# EAGLE design rpi-adapter (EAGLE 5.12)

## Sheet 1 of 7
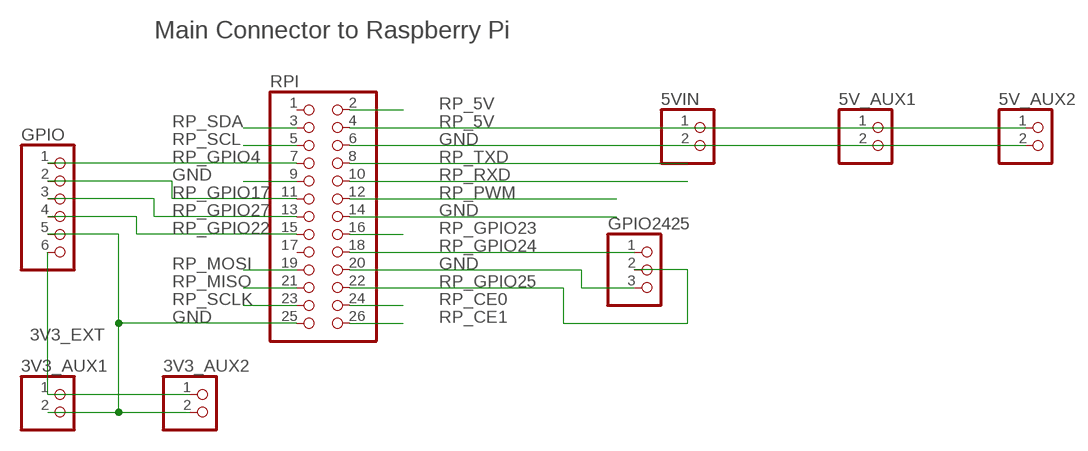
[diagram p0: schematic, sheet 1]

### Parts
3V3_AUX1  PINHD-1X2  [1X02]
3V3_AUX2  PINHD-1X2  [1X02]
5V_AUX1  PINHD-1X2  [1X02]
5V_AUX2  PINHD-1X2  [1X02]
5VIN  PINHD-1X2  [1X02]
GPIO  PINHD-1X6  [1X06]
GPIO2425  PINHD-1X3  [1X03]
RPI  PINHD-2X13  [2X13]

### Nets
3V3_EXT: 3V3_AUX1.1 3V3_AUX2.1 GPIO.6 ; also sheet 6,7
GND: 3V3_AUX1.2 3V3_AUX2.2 5V_AUX1.2 5V_AUX2.2 5VIN.2 GPIO2425.3 GPIO.5 RPI.6 RPI.9 RPI.14 RPI.20 RPI.25 ; also sheet 2,3,5,6,7
RP_5V: 5V_AUX1.1 5V_AUX2.1 5VIN.1 RPI.2 RPI.4 ; also sheet 2,4,5,6,7
RP_CE0: RPI.24 ; also sheet 3
RP_CE1: RPI.26 ; also sheet 2
RP_GPIO4: GPIO.1 RPI.7
RP_GPIO17: GPIO.2 RPI.11
RP_GPIO22: GPIO.4 RPI.15
RP_GPIO23: RPI.16 ; also sheet 2
RP_GPIO24: GPIO2425.1 RPI.18
RP_GPIO25: GPIO2425.2 RPI.22
RP_GPIO27: GPIO.3 RPI.13
RP_MISO: RPI.21 ; also sheet 2,3
RP_MOSI: RPI.19 ; also sheet 2,3
RP_PWM: RPI.12 ; also sheet 2
RP_RXD: RPI.10 ; also sheet 2
RP_SCL: RPI.5 ; also sheet 6
RP_SCLK: RPI.23 ; also sheet 2,3
RP_SDA: RPI.3 ; also sheet 6
RP_TXD: RPI.8 ; also sheet 2
Unconnected: RPI.1 RPI.17

### Notes on the sheet
- Main Connector to Raspberry Pi

## Sheet 2 of 7
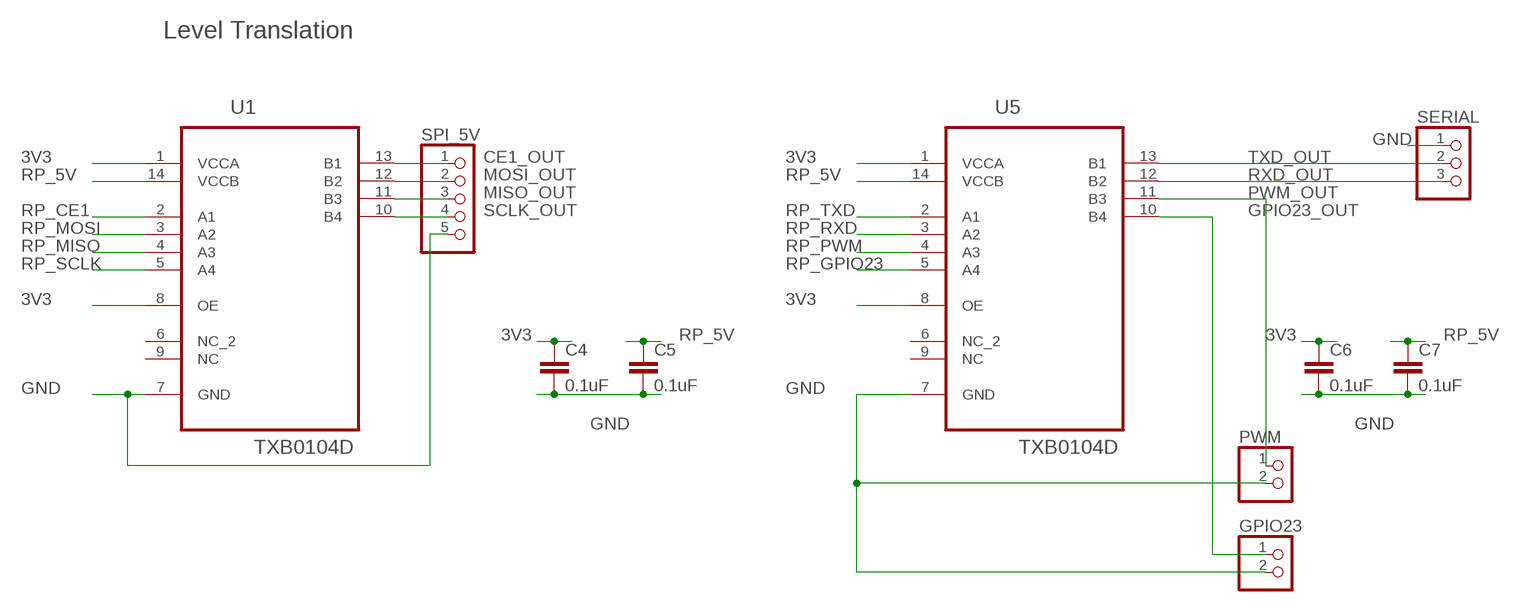
[diagram p1: schematic, sheet 2]

### Parts
C4  0.1uF  C-EUC0603  [C0603]
C5  0.1uF  C-EUC0603  [C0603]
C6  0.1uF  C-EUC0603  [C0603]
C7  0.1uF  C-EUC0603  [C0603]
GPIO23  PINHD-1X2  [1X02]
PWM  PINHD-1X2  [1X02]
SERIAL  PINHD-1X3  [1X03]
SPI_5V  PINHD-1X5  [1X05]
U1  TXB0104D  [SOIC127P600X175-14N]
U5  TXB0104D  [SOIC127P600X175-14N]

### Nets
3V3: C4.1 C6.1 U1.1(VCCA) U1.8(OE) U5.1(VCCA) U5.8(OE) ; also sheet 3,4,6,7
CE1_OUT: SPI_5V.1 U1.13(B1)
GND: C4.2 C5.2 C6.2 C7.2 GPIO23.2 PWM.2 SERIAL.1 SPI_5V.5 U1.7(GND) U5.7(GND) ; also sheet 1,3,5,6,7
GPIO23_OUT: GPIO23.1 U5.10(B4)
MISO_OUT: SPI_5V.3 U1.11(B3)
MOSI_OUT: SPI_5V.2 U1.12(B2)
PWM_OUT: PWM.1 U5.11(B3)
RP_5V: C5.1 C7.1 U1.14(VCCB) U5.14(VCCB) ; also sheet 1,4,5,6,7
RP_CE1: U1.2(A1) ; also sheet 1
RP_GPIO23: U5.5(A4) ; also sheet 1
RP_MISO: U1.4(A3) ; also sheet 1,3
RP_MOSI: U1.3(A2) ; also sheet 1,3
RP_PWM: U5.4(A3) ; also sheet 1
RP_RXD: U5.3(A2) ; also sheet 1
RP_SCLK: U1.5(A4) ; also sheet 1,3
RP_TXD: U5.2(A1) ; also sheet 1
RXD_OUT: SERIAL.3 U5.12(B2)
SCLK_OUT: SPI_5V.4 U1.10(B4)
TXD_OUT: SERIAL.2 U5.13(B1)
Unconnected: U1.6(NC_2) U1.9(NC) U5.6(NC_2) U5.9(NC)

### Notes on the sheet
- Level Translation

## Sheet 3 of 7
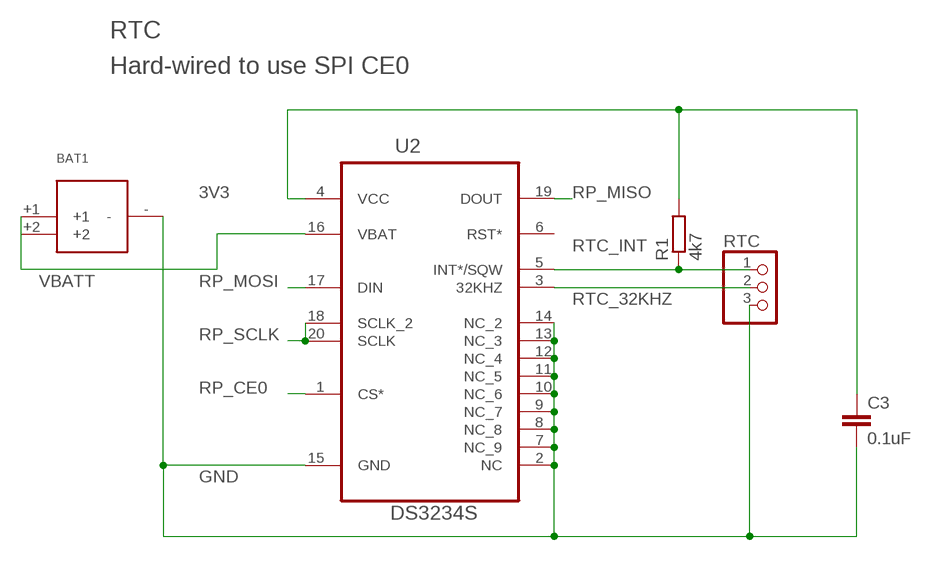
[diagram p2: schematic, sheet 3]

### Parts
BAT1  HU2032-LF  [HU2032-LF]
C3  0.1uF  C-EUC0603  [C0603]
R1  4k7  R-EU_R0805  [R0805]
RTC  PINHD-1X3  [1X03]
U2  DS3234S  [SOIC127P1032X265-20N]

### Nets
3V3: C3.1 R1.2 U2.4(VCC) ; also sheet 2,4,6,7
GND: BAT1.- C3.2 RTC.3 U2.2(NC) U2.7(NC_9) U2.8(NC_8) U2.9(NC_7) U2.10(NC_6) U2.11(NC_5) U2.12(NC_4) U2.13(NC_3) U2.14(NC_2) U2.15(GND) ; also sheet 1,2,5,6,7
RP_CE0: U2.1(CS*) ; also sheet 1
RP_MISO: U2.19(DOUT) ; also sheet 1,2
RP_MOSI: U2.17(DIN) ; also sheet 1,2
RP_SCLK: U2.18(SCLK_2) U2.20(SCLK) ; also sheet 1,2
RTC_32KHZ: RTC.2 U2.3(32KHZ)
RTC_INT: R1.1 RTC.1 U2.5(INT*/SQW)
VBATT: BAT1.+1 BAT1.+2 U2.16(VBAT)
Unconnected: U2.6(RST*)

### Notes on the sheet
- RTC
- Hard-wired to use SPI CE0

## Sheet 4 of 7
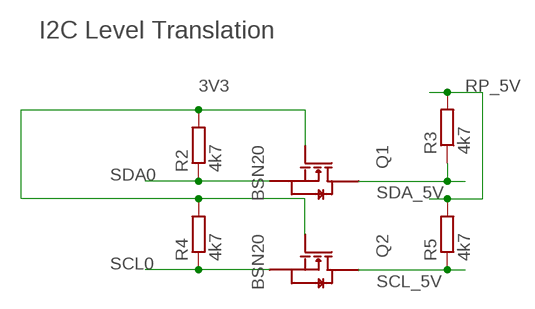
[diagram p3: schematic, sheet 4]

### Parts
Q1  BSN20  [SOT23]
Q2  BSN20  [SOT23]
R2  4k7  R-EU_R0603  [R0603]
R3  4k7  R-EU_R0603  [R0603]
R4  4k7  R-EU_R0603  [R0603]
R5  4k7  R-EU_R0603  [R0603]

### Nets
3V3: Q1.1(G) Q2.1(G) R2.2 R4.2 ; also sheet 2,3,6,7
RP_5V: R3.2 R5.2 ; also sheet 1,2,5,6,7
SCL0: Q2.2(S) R4.1 ; also sheet 6
SCL_5V: Q2.3(D) R5.1 ; also sheet 5,6
SDA0: Q1.2(S) R2.1 ; also sheet 6
SDA_5V: Q1.3(D) R3.1 ; also sheet 5,6

### Notes on the sheet
- I2C Level Translation

## Sheet 5 of 7
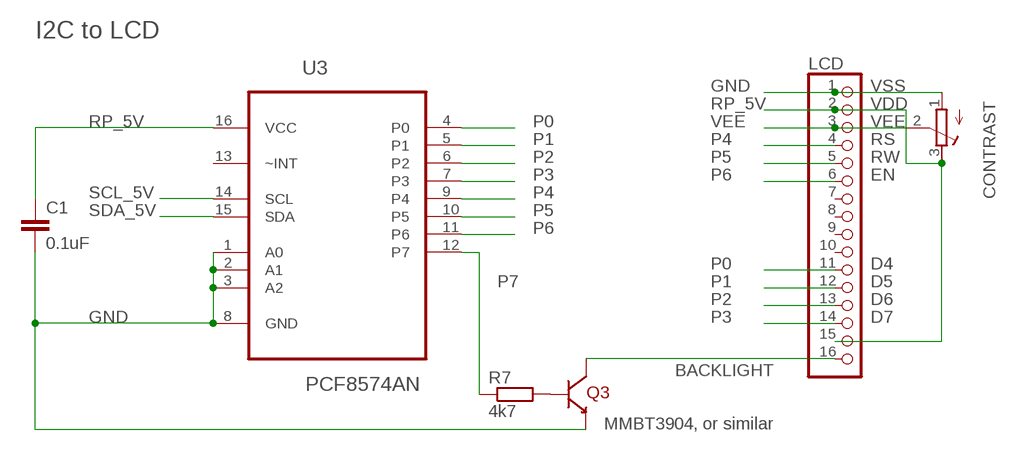
[diagram p4: schematic, sheet 5]

### Parts
C1  0.1uF  C-EUC0603  [C0603]
CONTRAST  R-TRIMM64W  [RTRIM64W]
LCD  PINHD-1X16  [1X16]
Q3  MMBT3904LT1-D  [SOT23]
R7  4k7  R-EU_R0603  [R0603]
U3  PCF8574AN  [DIP254P762X508-16]

### Nets
BACKLIGHT: LCD.16 Q3.3(3C)
GND: C1.2 CONTRAST.1(A) LCD.1 Q3.2(2E) U3.1(A0) U3.2(A1) U3.3(A2) U3.8(GND) ; also sheet 1,2,3,6,7
N$1: Q3.1(1B) R7.2
P0: LCD.11 U3.4(P0)
P1: LCD.12 U3.5(P1)
P2: LCD.13 U3.6(P2)
P3: LCD.14 U3.7(P3)
P4: LCD.4 U3.9(P4)
P5: LCD.5 U3.10(P5)
P6: LCD.6 U3.11(P6)
P7: R7.1 U3.12(P7)
RP_5V: C1.1 CONTRAST.3(E) LCD.2 LCD.15 U3.16(VCC) ; also sheet 1,2,4,6,7
SCL_5V: U3.14(SCL) ; also sheet 4,6
SDA_5V: U3.15(SDA) ; also sheet 4,6
VEE: CONTRAST.2(S) LCD.3
Unconnected: LCD.7 LCD.8 LCD.9 LCD.10 U3.13(~INT)

### Notes on the sheet
- I2C to LCD
- VSS
- VDD
- VEE
- RS
- RW
- EN
- D4
- D5
- D6
- D7
- MMBT3904, or similar

## Sheet 6 of 7
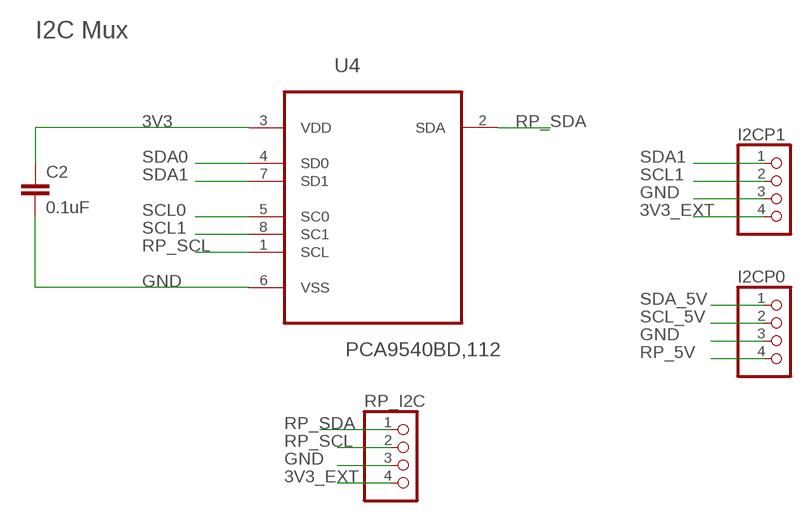
[diagram p5: schematic, sheet 6]

### Parts
C2  0.1uF  C-EUC0603  [C0603]
I2CP0  PINHD-1X4  [1X04]
I2CP1  PINHD-1X4  [1X04]
RP_I2C  PINHD-1X4  [1X04]
U4  PCA9540BD,112  [SOIC127P600X175-8N]

### Nets
3V3: C2.1 U4.3(VDD) ; also sheet 2,3,4,7
3V3_EXT: I2CP1.4 RP_I2C.4 ; also sheet 1,7
GND: C2.2 I2CP0.3 I2CP1.3 RP_I2C.3 U4.6(VSS) ; also sheet 1,2,3,5,7
RP_5V: I2CP0.4 ; also sheet 1,2,4,5,7
RP_SCL: RP_I2C.2 U4.1(SCL) ; also sheet 1
RP_SDA: RP_I2C.1 U4.2(SDA) ; also sheet 1
SCL0: U4.5(SC0) ; also sheet 4
SCL1: I2CP1.2 U4.8(SC1)
SCL_5V: I2CP0.2 ; also sheet 4,5
SDA0: U4.4(SD0) ; also sheet 4
SDA1: I2CP1.1 U4.7(SD1)
SDA_5V: I2CP0.1 ; also sheet 4,5

### Notes on the sheet
- I2C Mux

## Sheet 7 of 7
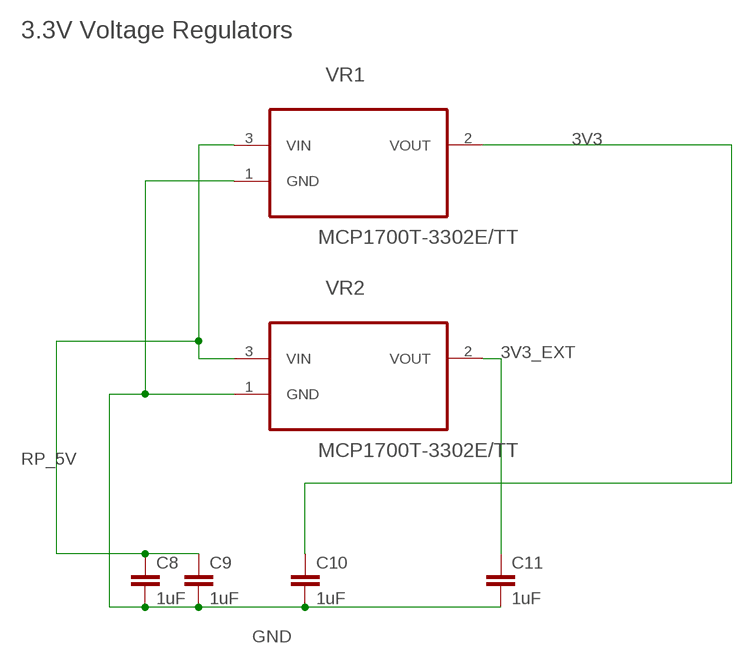
[diagram p6: schematic, sheet 7]

### Parts
C8  1uF  C-EUC0805  [C0805]
C9  1uF  C-EUC0805  [C0805]
C10  1uF  C-EUC0805  [C0805]
C11  1uF  C-EUC0805  [C0805]
VR1  MCP1700T-3302E/TT  [SOT95P237X112-3N]
VR2  MCP1700T-3302E/TT  [SOT95P237X112-3N]

### Nets
3V3: C10.1 VR1.2(VOUT) ; also sheet 2,3,4,6
3V3_EXT: C11.1 VR2.2(VOUT) ; also sheet 1,6
GND: C8.2 C9.2 C10.2 C11.2 VR1.1(GND) VR2.1(GND) ; also sheet 1,2,3,5,6
RP_5V: C8.1 C9.1 VR1.3(VIN) VR2.3(VIN) ; also sheet 1,2,4,5,6

### Notes on the sheet
- 3.3V Voltage Regulators

## Library data of the parts
3V3_AUX1 3V3_AUX2 5V_AUX1 5V_AUX2 5VIN GPIO23 PWM = pinhead:PINHD-1X2: PIN HEADER
BAT1 = mss:HU2032-LF: CR2032 Coin cell holder
C1-C11 = rcl:C-EU: CAPACITOR, European symbol
CONTRAST = rcl:R-TRIMM: Trimm resistor
GPIO = pinhead:PINHD-1X6: PIN HEADER
GPIO2425 RTC SERIAL = pinhead:PINHD-1X3: PIN HEADER
I2CP0 I2CP1 RP_I2C = pinhead:PINHD-1X4: PIN HEADER
LCD = pinhead:PINHD-1X16: PIN HEADER
Q1 Q2 = mss:BSN20: N-channel enhancement mode ?eld-effect transistor (NXP)
Q3 = mss:MMBT3904LT1-D: MMBT3904 General purpose NPN transistor VCEO 40V IC 200mA
R1-R5 R7 = rcl:R-EU_: RESISTOR, European symbol
RPI = pinhead:PINHD-2X13: PIN HEADER
SPI_5V = pinhead:PINHD-1X5: PIN HEADER
U1 U5 = mss:TXB0104D: 4-BIT BIDIRECTIONAL VOLTAGE-LEVEL TRANSLATOR WITH AUTOMATIC DIRECTION SENSING AND ±15-kV ESD PROTECTION; MPN: TXB0104D; OC_FARNELL: 1607890; OC_NEWARK: 99K4464; PACKAGE: SOIC-14; SUPPLIER: TEXAS INSTRUMENTS
U2 = mss:DS3234S: Extremely Accurate SPI Bus RTC with Integrated Crystal and SRAM; MPN: DS3234S#; OC_FARNELL: 1593294; OC_NEWARK: 74K5054; PACKAGE: SOIC-20; SUPPLIER: MAXIM INTEGRATED PRODUCTS
U3 = mss:PCF8574AN: REMOTE 8-BIT I/O EXPANDER FOR I2C BUS; MPN: PCF8574AN; OC_FARNELL: 1703443; OC_NEWARK: 75C5234; PACKAGE: PDIP-16; SUPPLIER: Texas Instruments
U4 = mss:PCA9540BD,112: 2-channel I2C-bus multiplexer; MPN: PCA9540BD,112; OC_FARNELL: 1831206; OC_NEWARK: 70R6561; PACKAGE: SOIC-8; SUPPLIER: NXP
VR1 VR2 = mss:MCP1700T-3302E/TT: Low Quiescent Current LDO; MPN: MCP1700T-3302E/TT; OC_FARNELL: 1296592; OC_NEWARK: 88H9817; PACKAGE: SOT23-3; SUPPLIER: Microchip

## Board
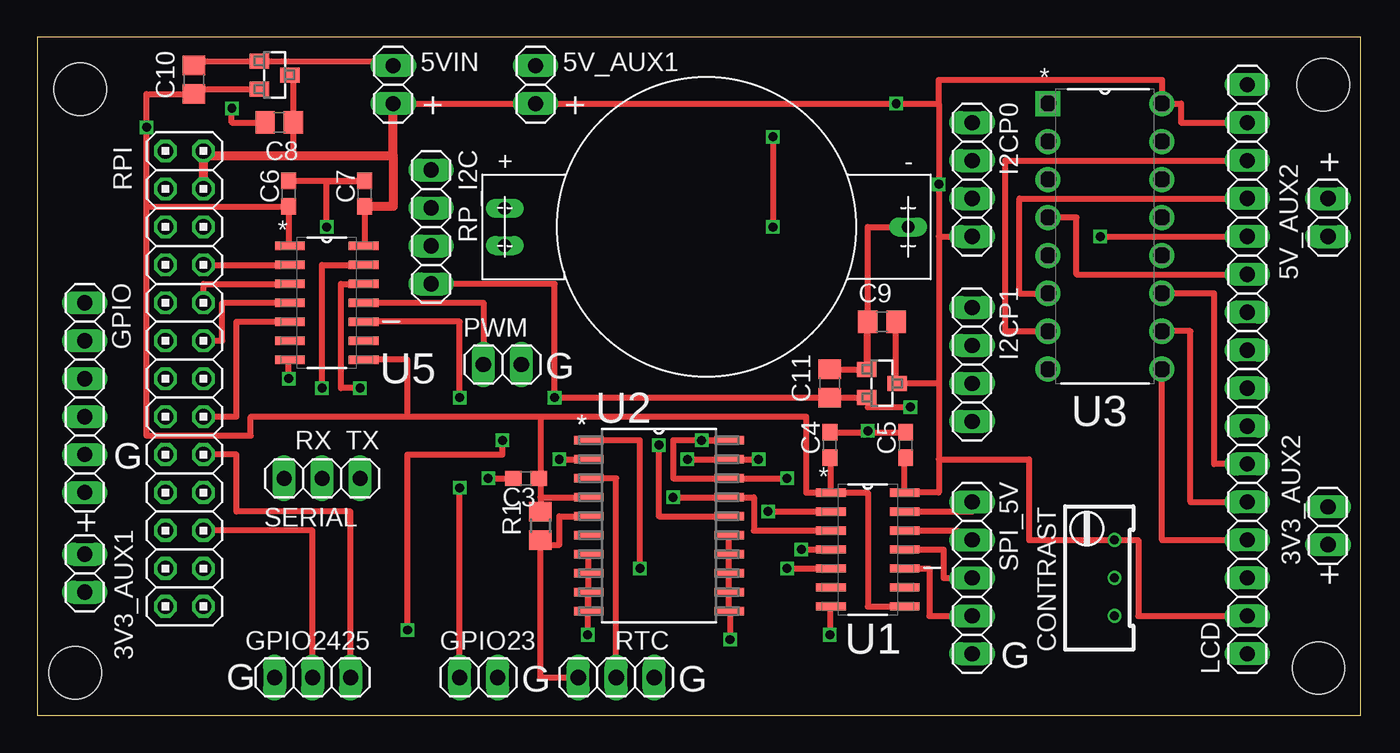
[diagram p7: board, top side]
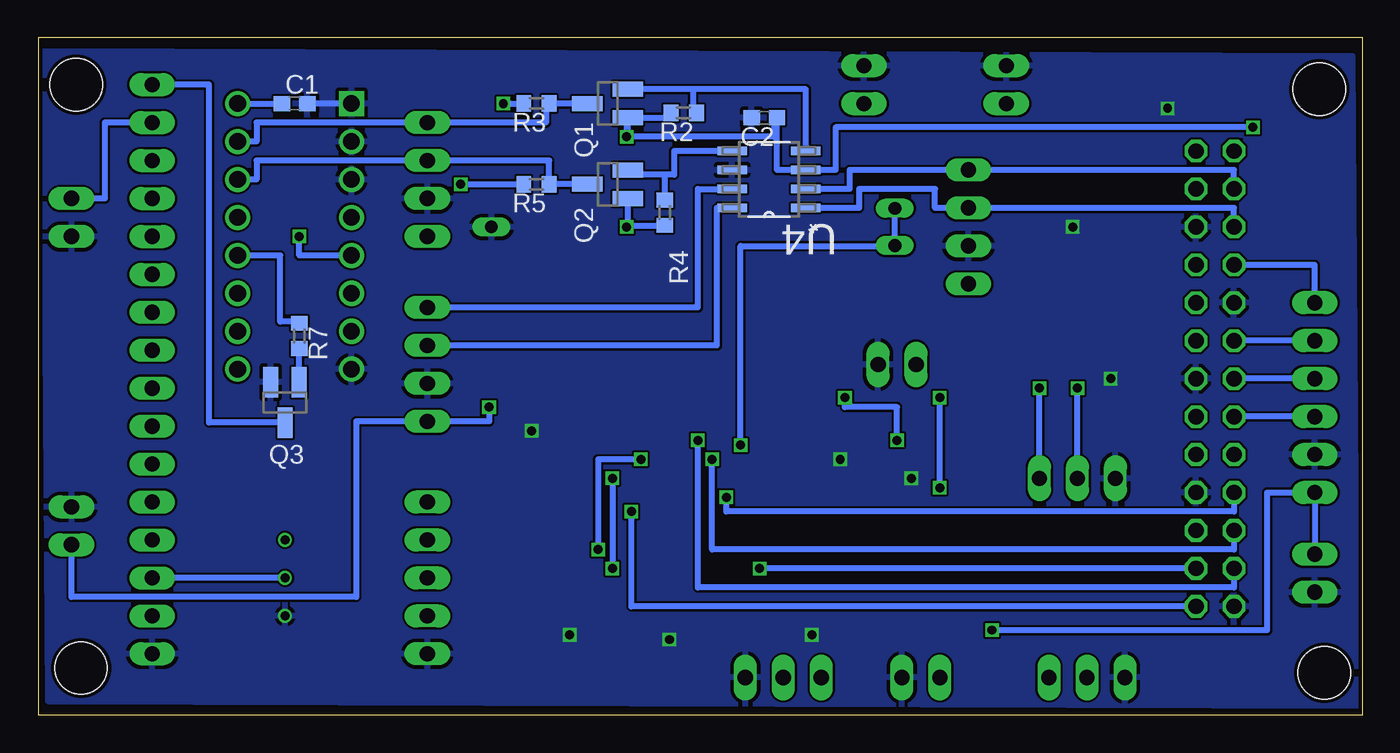
[diagram p8: board, bottom side, seen from below]

Size 88.56 x 45.39 mm. Coordinates in mm from the lower left corner, seen from the top.
Outline: 0,0 88.56,0 88.56,45.39 0,45.39 0,0
Copper layers (1*2*15*16): Top 0.035mm / dielectric 0.2mm / Route2 0.0175mm / dielectric 1.1mm / Route15 0.0175mm / dielectric 0.2mm / Bottom 0.035mm
Design rules "SeeedStudio_DRU_no_angle_20130527": minimum track width 6mil, minimum drill 12mil, track to track 6mil, track to pad 6mil, pad to pad 6mil, via to via 6mil, smd to smd 0mil, copper to edge 10mil, drill to drill 10mil, minimum pad ring 6mil, minimum via ring 6mil, stop-mask expansion 2mil, vias tented up to drill 25mil, thermal gap 10mil
Holes 3.5 mm at 2.54,2.86 2.86,41.91 86.04,42.23 85.72,3.17

### Footprints (pad centres in the part's own frame; a part is rotated, then mirrored left to right if it is on the bottom)
1X02 = drill 1.016 long: 1 -1.27,0; 2 1.27,0
HU2032-LF = drill 0.85 long: +1 -13.5,1.25; +2 -13.5,-1.25; - 13.5,0
C0603 = smd 1.1 x 1: 1 -0.85,0; 2 0.85,0
C0805 = smd 1.3 x 1.5: 1 -0.95,0; 2 0.95,0
RTRIM64W = drill 0.61 round: 1 1.27,-2.54; 2 1.27,0; 3 1.27,2.54
1X06 = drill 1.016 long: 1 -6.35,0; 2 -3.81,0; 3 -1.27,0; 4 1.27,0; 5 3.81,0; 6 6.35,0
1X03 = drill 1.016 long: 1 -2.54,0; 2 0,0; 3 2.54,0
1X04 = drill 1.016 long: 1 -3.81,0; 2 -1.27,0; 3 1.27,0; 4 3.81,0
1X16 = drill 1.016 long: 1 -19.05,0; 2 -16.51,0; 3 -13.97,0; 4 -11.43,0; 5 -8.89,0; 6 -6.35,0; 7 -3.81,0; 8 -1.27,0; 9 1.27,0; 10 3.81,0; 11 6.35,0; 12 8.89,0; 13 11.43,0; 14 13.97,0; 15 16.51,0; 16 19.05,0
SOT23 = smd 1 x 2.032: 1 -0.95,-1.354; 2 0.95,-1.354; 3 0,1.354
R0805 = smd 1.3 x 1.5: 1 -0.95,0; 2 0.95,0
R0603 = smd 1 x 1.1: 1 -0.85,0; 2 0.85,0
2X13 = drill 1.016 octagon: 1 -15.24,-1.27; 2 -15.24,1.27; 3 -12.7,-1.27; 4 -12.7,1.27; 5 -10.16,-1.27; 6 -10.16,1.27; 7 -7.62,-1.27; 8 -7.62,1.27; 9 -5.08,-1.27; 10 -5.08,1.27; 11 -2.54,-1.27; 12 -2.54,1.27; 13 0,-1.27; 14 0,1.27; 15 2.54,-1.27; 16 2.54,1.27; 17 5.08,-1.27; 18 5.08,1.27; 19 7.62,-1.27; 20 7.62,1.27; 21 10.16,-1.27; 22 10.16,1.27; 23 12.7,-1.27; 24 12.7,1.27; 25 15.24,-1.27; 26 15.24,1.27
1X05 = drill 1.016 long: 1 -5.08,0; 2 -2.54,0; 3 0,0; 4 2.54,0; 5 5.08,0
SOIC127P600X175-14N = smd 1.981 x 0.559: 1 -2.464,3.81; 2 -2.464,2.54; 3 -2.464,1.27; 4 -2.464,0; 5 -2.464,-1.27; 6 -2.464,-2.54; 7 -2.464,-3.81; 8 2.464,-3.81; 9 2.464,-2.54; 10 2.464,-1.27; 11 2.464,0; 12 2.464,1.27; 13 2.464,2.54; 14 2.464,3.81
SOIC127P1032X265-20N = smd 1.981 x 0.559: 1 -4.699,5.715; 2 -4.699,4.445; 3 -4.699,3.175; 4 -4.699,1.905; 5 -4.699,0.635; 6 -4.699,-0.635; 7 -4.699,-1.905; 8 -4.699,-3.175; 9 -4.699,-4.445; 10 -4.699,-5.715; 11 4.699,-5.715; 12 4.699,-4.445; 13 4.699,-3.175; 14 4.699,-1.905; 15 4.699,-0.635; 16 4.699,0.635; 17 4.699,1.905; 18 4.699,3.175; 19 4.699,4.445; 20 4.699,5.715
DIP254P762X508-16 = drill 1.118 square: 1 -7.62,17.78 | drill 1.118 round: 2 -7.62,15.24; 3 -7.62,12.7; 4 -7.62,10.16; 5 -7.62,7.62; 6 -7.62,5.08; 7 -7.62,2.54; 8 -7.62,0; 9 0,0; 10 0,2.54; 11 0,5.08; 12 0,7.62; 13 0,10.16; 14 0,12.7; 15 0,15.24; 16 0,17.78
SOIC127P600X175-8N = smd 1.981 x 0.559: 1 -2.464,1.905; 2 -2.464,0.635; 3 -2.464,-0.635; 4 -2.464,-1.905; 5 2.464,-1.905; 6 2.464,-0.635; 7 2.464,0.635; 8 2.464,1.905
SOT95P237X112-3N = smd 0.991 x 1.321: 1 -0.94,-1.016; 2 0.94,-1.016; 3 0,1.016

### Placement (x,y rotation side)
3V3_AUX1  3.17,9.53 270 top
3V3_AUX2  86.36,12.7 90 top
5V_AUX1  33.34,42.23 90 top
5V_AUX2  86.36,33.34 270 top
5VIN  23.81,42.23 90 top
BAT1  44.77,32.7 0 top
C1  71.44,40.96 0 bottom
C2  40.01,40.01 180 bottom
C3  32.7,15.88 180 top
C4  53.02,18.1 90 top
C5  58.1,18.1 90 top
C6  16.83,34.92 90 top
C7  21.91,34.92 90 top
C8  16.19,39.69 180 top
C9  56.52,26.35 180 top
C10  10.48,42.55 90 top
C11  53.02,22.23 90 top
CONTRAST  70.8,9.21 0 top
GPIO  3.17,21.27 270 top
GPIO23  29.53,2.54 0 top
GPIO2425  18.41,2.54 180 top
I2CP0  62.55,35.88 270 top
I2CP1  62.55,23.5 270 top
LCD  80.96,23.18 90 top
PWM  31.11,23.5 0 top
Q1  50.48,40.96 90 bottom
Q2  50.48,35.56 90 bottom
Q3  72.07,20.95 180 bottom
R1  33.66,12.7 90 top
R2  45.4,40.32 180 bottom
R3  55.24,40.96 180 bottom
R4  46.67,33.66 270 bottom
R5  55.24,35.56 180 bottom
R7  71.12,25.4 270 bottom
RP_I2C  26.35,32.7 270 top
RPI  9.84,22.54 270 top
RTC  38.73,2.54 0 top
SERIAL  19.05,15.88 0 top
SPI_5V  62.55,9.21 270 top
U1  55.56,11.11 0 top
U2  41.59,12.7 0 top
U3  75.25,23.18 0 top
U4  39.69,35.88 180 bottom
U5  19.37,27.62 0 top
VR1  15.88,42.86 270 top
VR2  56.52,22.23 270 top

### Tracks (layer width: path | path; a pad name or v marks a point on that pad's centre or on a via)
3V3  (via drill 0.6)
  Top 0.406: C4.1 53.1,17.25 U1.1 | U1.8 55.56,7.3 55.56,14.92 U1.1 | U1.1 51.44,14.92 51.44,20 33.66,20 | 33.66,14.61 U2.4 | 33.66,14.61 R1.2 | v49.21,38.73 v49.21,32.7 | 33.66,15.88 33.66,14.61 | 33.66,20 33.66,15.88 | 33.66,15.88 C3.1 | 24.77,20 14.29,20 14.29,18.73 7.3,18.73 7.3,34.08 | 24.77,20 33.66,20 | U5.1 16.83,31.43 C6.1 7.3,34.08 | U5.8 24.77,23.81 24.77,20 | C10.1 7.3,41.59 v7.3,39.37 7.3,34.08 | 10.48,41.92 VR1.2
  Top 0.61: C10.1 10.48,41.92
  Bottom 0.406: Q1.1 49.13,38.73 39.37,38.73 39.37,40.01 C2.1 39.16,36.51 U4.3 35.24,36.51 35.24,39.37 v7.3,39.37 | Q1.1 49.21,40.01 v49.21,38.73 | Q2.1 49.13,32.7 v49.21,32.7 49.21,32.8 R4.2 | Q1.1 46.25,40.01 R2.2
3V3_EXT  (via drill 0.6)
  Top 0.406: v58.42,20.64 55.56,20.64 55.56,21.29 VR2.2 C11.1 v34.61,21.27 34.61,28.89 RP_I2C.4 | v24.77,5.71 24.77,17.46 31.11,17.46 v31.11,18.41
  Bottom 0.406: v58.42,20.64 58.42,19.68 I2CP1.4 67.31,19.68 67.31,7.94 86.36,7.94 3V3_AUX2.1 | v24.77,5.71 6.35,5.71 6.35,14.92 GPIO.6 3V3_AUX1.1 | v31.11,18.41 31.11,20.64 34.61,20.64 v34.61,21.27
BACKLIGHT
  Bottom 0.406: Q3.3 77.15,19.6 77.15,42.23 LCD.16
CE1_OUT
  Top 0.406: U1.13 62.55,13.65 SPI_5V.1
GND  (via drill 0.6)
  Top 0.406: U2.7 U2.8 U2.9 | U2.10 U2.9 | U2.9 36.83,8.26 v36.83,5.4 | U2.15 U2.14 U2.13 U2.12 U2.11 46.35,6.99 v46.35,5.08 | v34.92,17.14 U2.2 | C4.2 55.88,18.95 | 55.88,18.95 C5.2 | v55.56,19.05 55.88,19.05 55.88,18.95 | U1.7 53.02,7.3 v53.02,5.4 53.02,5.71 | v30.16,15.88 C3.2 | U5.7 16.83,23.81 v16.83,22.54 | C6.2 C7.2 19.37,35.77 v19.37,32.7 | 10.48,43.8 VR1.1 23.81,43.8 5VIN.2 | C8.2 13.02,39.69 v13.02,40.64 | C9.2 55.5,26.35 VR2.1 | VR2.1 53.02,23.16 C11.2 | VR2.1 55.56,23.16 55.56,32.7 BAT1.-
  Top 0.61: C10.2 10.48,43.8
  Bottom 0.406: U3.1 70.48,40.96
  pour Bottom: 0.64,44.13 88.27,44.45 87.95,0.95 0.32,0.64
GPIO23_OUT  (via drill 0.6)
  Top 0.406: U5.10 28.26,26.35 v28.26,21.27 | GPIO23.1 v28.26,15.24
  Bottom 0.406: v28.26,15.24 v28.26,21.27
MISO_OUT
  Top 0.406: U1.11 60.64,11.11 60.64,9.21 SPI_5V.3
MOSI_OUT
  Top 0.406: U1.12 61.59,12.38 61.59,11.75 SPI_5V.2
N$1
  Bottom 0.406: R7.2 Q3.1
P0
  Top 0.406: LCD.11 69.53,29.53 69.53,33.34 U3.4
P1  (via drill 0.6)
  Top 0.406: v71.12,32.07 LCD.12
  Bottom 0.406: v71.12,32.07 71.12,30.8 U3.5
P2
  Top 0.406: LCD.13 65.72,34.61 65.72,28.26 U3.6
P3
  Top 0.406: LCD.14 64.77,37.15 64.77,25.72 U3.7
P4
  Top 0.406: LCD.4 75.25,11.75 U3.9
P5
  Top 0.406: U3.10 77.15,25.72 77.15,14.29 LCD.5
P6
  Top 0.406: U3.11 78.74,28.26 78.74,16.83 LCD.6
P7
  Bottom 0.406: U3.12 72.39,30.8 72.39,26.35 71.12,26.35 R7.1
PWM_OUT
  Top 0.406: U5.11 29.84,27.62 PWM.1
RP_5V  (via drill 0.6)
  Top 0.406: C5.1 58.03,17.25 U1.14 60.33,14.92 60.33,17.14 | 60.33,32.07 60.33,22.23 | 60.33,22.23 60.33,17.14 | 60.33,40.96 v57.47,40.96 5V_AUX1.1 5VIN.1 | 60.33,40.96 v60.33,35.56 60.33,32.07 | 60.33,40.96 60.33,42.55 75.25,42.55 U3.16 76.52,40.96 76.52,39.69 LCD.15 | 60.33,17.14 66.36,17.14 66.36,11.75 CONTRAST.3 73.66,11.75 73.66,6.67 LCD.2 | U5.14 21.91,31.43 C7.1 | 60.33,32.07 I2CP0.4 | VR1.3 17.14,42.86 C8.1 | 16.89,39.69 C8.1 17.14,37.47 | 60.33,22.23 VR2.3 57.47,22.23 C9.1
  Top 0.61: RPI.4 RPI.2 11.11,37.47 17.14,37.47 23.81,37.47 | 23.81,37.47 5VIN.1 | C7.1 23.81,34.08 23.81,37.47 | C8.1 16.89,39.69
  Bottom 0.406: v57.47,40.96 R3.2 | v60.33,35.56 R5.2 | U3.16 C1.1 | LCD.15 84.14,39.69 84.14,34.61 5V_AUX2.1
RP_CE0  (via drill 0.6)
  Top 0.406: v40.32,9.84 40.32,18.41 U2.1
  Bottom 0.406: RPI.24 v40.32,9.84
RP_CE1  (via drill 0.6)
  Top 0.406: v48.9,13.65 U1.2
  Bottom 0.406: RPI.26 48.9,7.3 v48.9,13.65
RP_GPIO4
  Bottom 0.406: RPI.7 3.17,30.16 GPIO.1
RP_GPIO17
  Bottom 0.406: GPIO.2 RPI.11
RP_GPIO22
  Bottom 0.406: GPIO.4 RPI.15
RP_GPIO23
  Top 0.406: RPI.16 13.34,20 13.34,26.35 U5.5
RP_GPIO24
  Top 0.406: RPI.18 13.34,17.46 13.34,13.65 20.95,13.65 GPIO2425.1
RP_GPIO25
  Top 0.406: RPI.22 18.41,12.38 GPIO2425.2
RP_GPIO27
  Bottom 0.406: GPIO.3 RPI.13
RP_MISO  (via drill 0.6)
  Top 0.406: v43.5,17.14 U2.19 v48.26,17.14 | v51.12,11.11 U1.4
  Bottom 0.406: RPI.21 8.57,11.11 43.5,11.11 v43.5,17.14 | v48.26,17.14 51.12,17.14 v51.12,11.11
RP_MOSI  (via drill 0.6)
  Top 0.406: v42.55,14.61 U2.17 47.94,14.61 47.94,12.38 U1.3
  Bottom 0.406: RPI.19 8.57,13.65 42.55,13.65 v42.55,14.61
RP_PWM
  Top 0.406: U5.4 12.38,27.62 12.38,25.08 RPI.12
RP_RXD
  Top 0.406: U5.3 11.11,28.89 RPI.10
RP_SCL
  Bottom 0.406: RPI.5 8.57,33.97 RP_I2C.2 28.57,33.97 28.57,35.24 33.66,35.24 33.66,33.97 U4.1
RP_SCLK  (via drill 0.6)
  Top 0.406: v44.45,18.41 U2.20 42.55,18.41 42.55,15.88 U2.18 v50.16,15.88 | v50.16,9.84 U1.5
  Bottom 0.406: RPI.23 8.57,8.57 44.45,8.57 v44.45,18.41 | v50.16,15.88 v50.16,9.84
RP_SDA
  Bottom 0.406: RPI.3 8.57,36.51 RP_I2C.1 34.29,36.51 34.29,35.24 U4.2
RP_TXD
  Top 0.406: RPI.8 U5.2
RTC_32KHZ
  Top 0.406: U2.3 38.73,15.88 RTC.2
RTC_INT
  Top 0.406: U2.5 34.92,13.34 34.92,11.43 33.66,11.43 | 33.66,11.43 33.66,2.54 RTC.1 | 33.66,11.43 R1.1
RXD_OUT  (via drill 0.6)
  Top 0.406: U5.12 20.32,28.89 20.32,21.91 v21.59,21.91
  Bottom 0.406: SERIAL.3 v21.59,21.91
SCL0
  Bottom 0.406: U4.5 46.04,37.78 46.04,36.2 46.67,36.2 | 46.67,36.2 49.13,36.2 Q2.2 | 46.67,36.2 R4.1
SCL1
  Bottom 0.406: U4.8 43.18,33.97 43.18,24.77 I2CP1.2
SCL_5V
  Bottom 0.406: Q2.3 R5.1 54.4,37.15 I2CP0.2 73.98,37.15 73.98,35.88 U3.14
SCLK_OUT
  Top 0.406: U1.10 59.69,9.84 59.69,6.67 SPI_5V.4
SDA0
  Bottom 0.406: 44.77,41.91 37.22,41.91 U4.4 | 44.77,41.91 Q1.2 | R2.1 44.77,40.32 44.77,41.91
SDA1
  Bottom 0.406: U4.7 44.45,35.24 44.45,27.3 I2CP1.1
SDA_5V
  Bottom 0.406: Q1.3 R3.1 54.61,40.96 54.61,39.69 I2CP0.1 73.98,39.69 73.98,38.42 U3.15
TXD_OUT  (via drill 0.6)
  Top 0.406: U5.13 19.05,30.16 v19.05,21.91
  Bottom 0.406: SERIAL.2 v19.05,21.91
VBATT  (via drill 0.6)
  Top 0.406: U2.16 41.59,13.34 v41.59,18.1 | BAT1.+2 31.27,31.43
  Bottom 0.406: v41.59,18.1 41.59,31.43 31.27,31.43 BAT1.+2 BAT1.+1
VEE
  Bottom 0.406: CONTRAST.2 LCD.3

### Text on the board
tNames: + | + | + | G | RX | TX | G | + | + | G | G | G | G